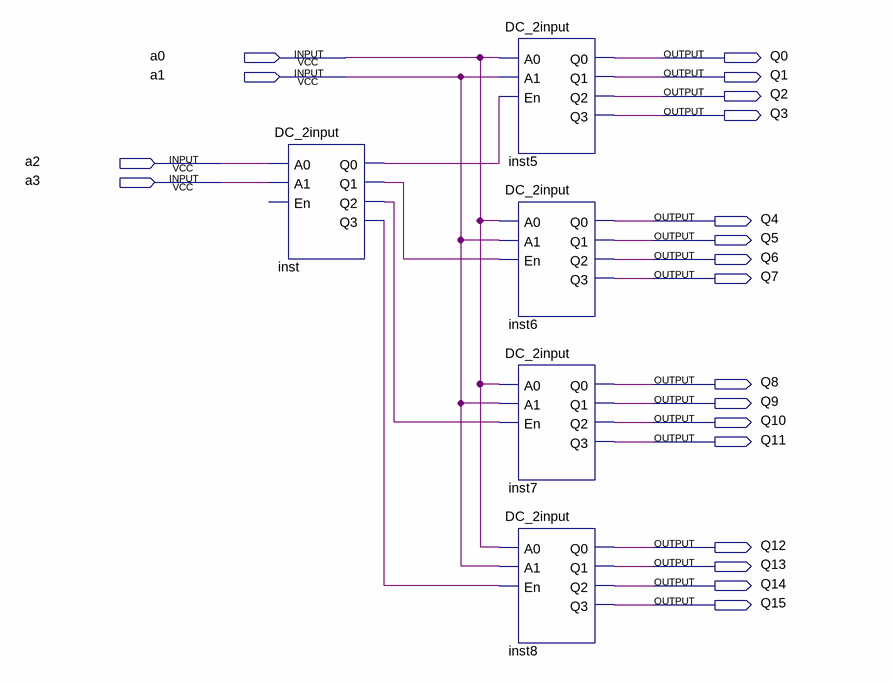
[diagram p0: schematic sheet]
// Quartus schematic DC_cascading.bdf as structural Verilog: 5 symbols, 20 pins
module DC_cascading (
  input  a0,
  input  a1,
  input  a2,
  input  a3,
  output Q0,
  output Q1,
  output Q2,
  output Q3,
  output Q4,
  output Q5,
  output Q6,
  output Q7,
  output Q8,
  output Q9,
  output Q10,
  output Q11,
  output Q12,
  output Q13,
  output Q14,
  output Q15
);

  wire inst_q0, inst_q1, inst_q2, inst_q3;

  DC_2input inst (.A0(a2), .A1(a3), .Q0(inst_q0), .Q1(inst_q1), .Q2(inst_q2), .Q3(inst_q3));  // open: En
  DC_2input inst5 (.A0(a0), .A1(a1), .En(inst_q0), .Q0(Q0), .Q1(Q1), .Q2(Q2), .Q3(Q3));
  DC_2input inst6 (.A0(a0), .A1(a1), .En(inst_q1), .Q0(Q4), .Q1(Q5), .Q2(Q6), .Q3(Q7));
  DC_2input inst7 (.A0(a0), .A1(a1), .En(inst_q2), .Q0(Q8), .Q1(Q9), .Q2(Q10), .Q3(Q11));
  DC_2input inst8 (.A0(a0), .A1(a1), .En(inst_q3), .Q0(Q12), .Q1(Q13), .Q2(Q14), .Q3(Q15));
endmodule
